# EasyEDA schematic SCH_esp32_custom.json
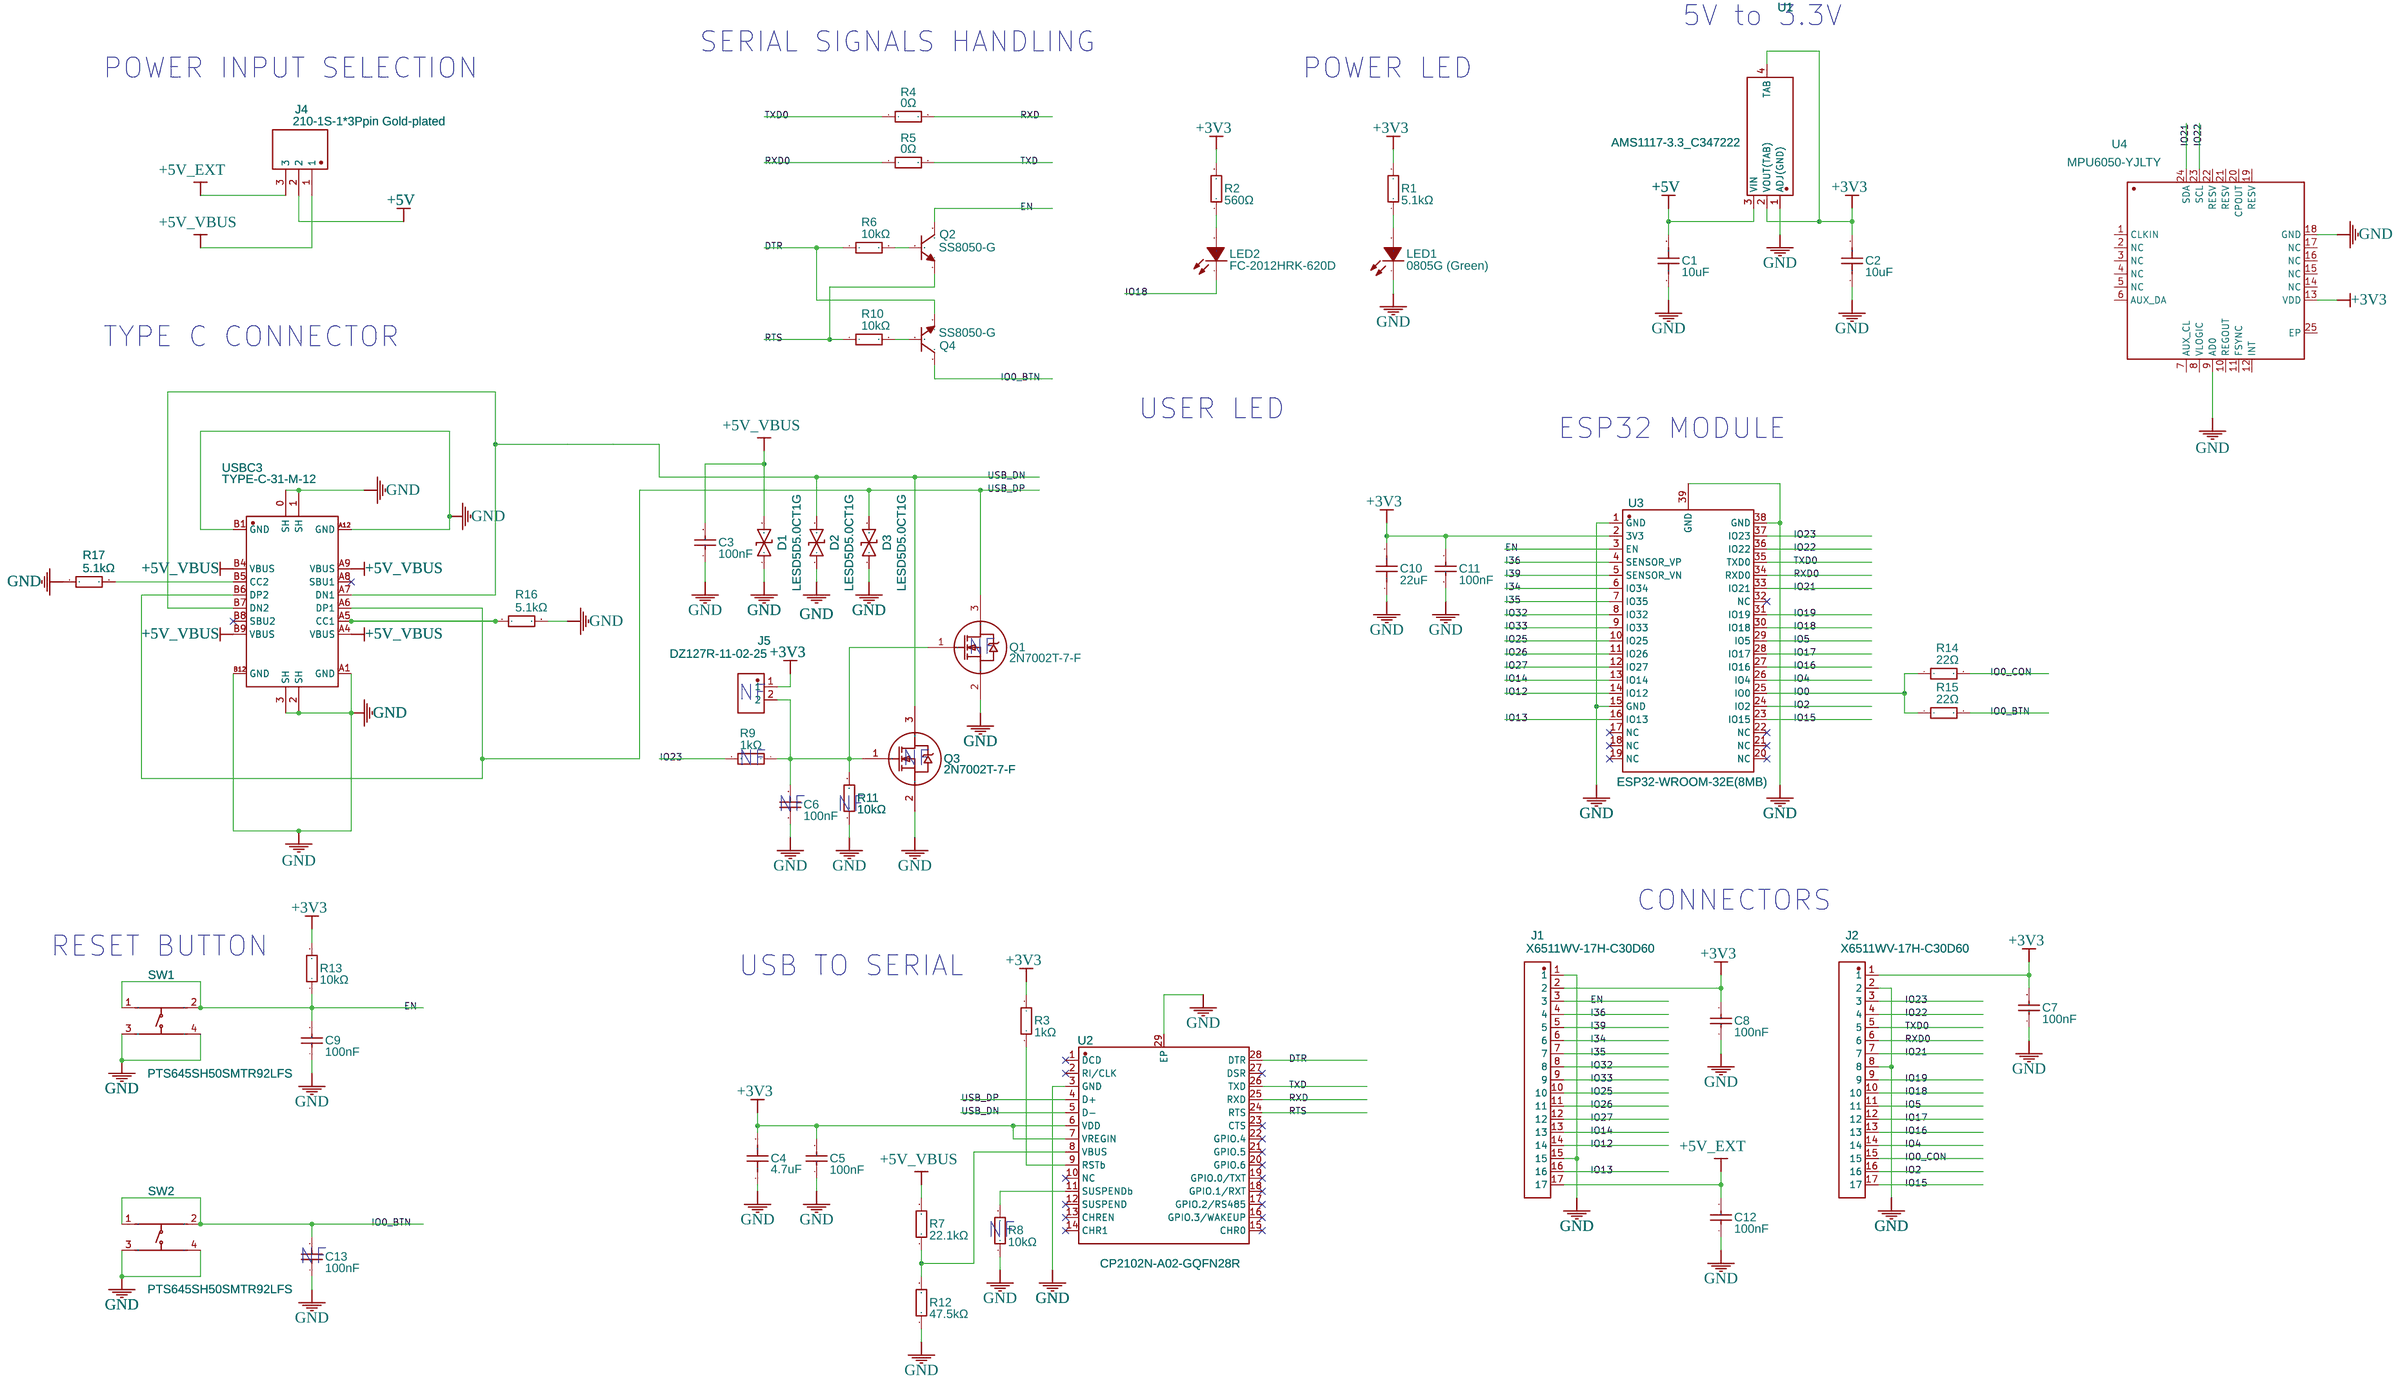
[diagram p0: schematic sheet]

## Parts
C1  10uF  [C0402]
C2  10uF  [C0402]
C3  100nF  [C0402_NEW]
C4  4.7uF  [C0402]
C5  100nF  [C0402_NEW]
C6  100nF  [C0402_NEW]
C7  100nF  [C0402_NEW]
C8  100nF  [C0402_NEW]
C9  100nF  [C0402_NEW]
C10  22uF  [C0805]
C11  100nF  [C0402_NEW]
C12  100nF  [C0402_NEW]
C13  100nF  [C0402_NEW]
D1  LESD5D5.0CT1G  [SOD-523_L1.2-W0.8-LS1.6-BI]
D2  LESD5D5.0CT1G  [SOD-523_L1.2-W0.8-LS1.6-BI]
D3  LESD5D5.0CT1G  [SOD-523_L1.2-W0.8-LS1.6-BI]
J1  X6511WV-17H-C30D60  [HDR-TH_17P-P2.54-V-M]
J2  X6511WV-17H-C30D60  [HDR-TH_17P-P2.54-V-M]
J4  210-1S-1*3Ppin Gold-plated  [HDR-TH_3P-P1.27-V-M-1]
J5  DZ127R-11-02-25  [HDR-TH_2P-P1.27-V-M]
LED1  0805G (Green)  [LED0805-RD_GREEN]
LED2  FC-2012HRK-620D  [LED0805-RD_RED]
Q1  2N7002T-7-F  [SOT-523-3_L1.6-W0.8-P1.00-LS1.6-BR]
Q2  SS8050-G  [SOT-23-3_L2.9-W1.6-P1.90-LS2.8-BR]
Q3  2N7002T-7-F  [SOT-523-3_L1.6-W0.8-P1.00-LS1.6-BR]
Q4  SS8050-G  [SOT-23-3_L2.9-W1.6-P1.90-LS2.8-BR]
R1  5.1kΩ  [R0402]
R2  560Ω  [R0402]
R3  1kΩ  [R0402]
R4  0Ω  [R0402]
R5  0Ω  [R0402]
R6  10kΩ  [R0402]
R7  22.1kΩ  [R0402]
R8  10kΩ  [R0402]
R9  1kΩ  [R0402]
R10  10kΩ  [R0402]
R11  10kΩ  [R0402]
R12  47.5kΩ  [R0402]
R13  10kΩ  [R0402]
R14  22Ω  [R0402]
R15  22Ω  [R0402]
R16  5.1kΩ  [R0603]
R17  5.1kΩ  [R0603]
SW1  PTS645SH50SMTR92LFS  [KEY-SMD_4P-L6.0-W6.0-P4.50-LS9.0]
SW2  PTS645SH50SMTR92LFS  [KEY-SMD_4P-L6.0-W6.0-P4.50-LS9.0]
U1  AMS1117-3.3_C347222  [SOT-223-4_L6.5-W3.5-P2.30-LS7.0-BR]
U2  CP2102N-A02-GQFN28R  [QFN-28_L5.0-W5.0-P0.50-TL-EP3.3]
U3  ESP32-WROOM-32E(8MB)  [WIFI-SMD_ESP32-WROOM-32E]
U4  MPU6050-YJLTY  [QFN-24_L4.0-W4.0-P0.50-BL-EP2.7]
USBC3  TYPE-C-31-M-12  [USB-C_SMD-TYPE-C-31-M-12]

## Library data of the parts
C1 C2 = CL05A106MP5NUNC_C315248: Supplier: LCSC; Supplier Part: C315248; Manufacturer: Samsung Electro-Mechanics; Manufacturer Part: CL05A106MP5NUNC; Contributor: LCSC; JLCPCB Part Class: Extended Part
C3 C5-C9 C11-C13 = CL05B104KO5NNNC: Supplier: LCSC; Manufacturer: SAMSUNG; Supplier Part: C1525; JLCPCB Part Class: Basic Part
C4 = CL05A475KP5NRNC: Supplier: LCSC; Supplier Part: C368809; Manufacturer: Samsung Electro-Mechanics; Contributor: LCSC; JLCPCB Part Class: Extended Part
C10 = CL21A226MAYNNNE: Supplier: LCSC; Supplier Part: C602037; Manufacturer: Samsung Electro-Mechanics; Contributor: LCSC; JLCPCB Part Class: Extended Part
D1-D3 = LESD5D5.0CT1G: Supplier: LCSC; Supplier Part: C383211; Manufacturer: Leshan Radio; Contributor: LCSC; JLCPCB Part Class: Extended Part
J1 J2 = X6511WV-17H-C30D60: Supplier: LCSC; Supplier Part: C725949; Manufacturer: XKB Connectivity; Contributor: LCSC; JLCPCB Part Class: Extended Part
J4 = 210-1S-1*3Ppin Gold-plated: Supplier: LCSC; Manufacturer: Ckmtw; Contributor: LCSC; Supplier Part: C124354; JLCPCB Part Class: Extended Part
J5 = DZ127R-11-02-25: Supplier: LCSC; Supplier Part: C2935942; Manufacturer: DEALON(德艺隆); Contributor: LCSC; JLCPCB Part Class: Extended Part
LED1 = 0805G (Green): Supplier: LCSC; Manufacturer: KENTO; Supplier Part: C2297; JLCPCB Part Class: Basic Part
LED2 = FC-2012HRK-620D: Supplier: LCSC; Manufacturer: NATIONSTAR; Supplier Part: C84256; JLCPCB Part Class: Basic Part
Q1 Q3 = 2N7002T-7-F: Supplier: LCSC; Manufacturer: DIODES; Contributor: LCSC; Supplier Part: C139445; JLCPCB Part Class: Extended Part
Q2 Q4 = SS8050-G: Supplier: LCSC; Manufacturer: CJ(江苏长电/长晶); Contributor: LCSC; Supplier Part: C164886; JLCPCB Part Class: Extended Part
R1 = 0402WGF5101TCE: Supplier: LCSC; Manufacturer: UniOhm; Supplier Part: C25905; Resistance (Ohms): 5.1K; JLCPCB Part Class: Basic Part
R2 = 0402WGF5600TCE: Supplier: LCSC; Manufacturer: UniOhm; Supplier Part: C25126; Resistance (Ohms): 560; JLCPCB Part Class: Extended Part
R3 R9 = 0402WGF1001TCE: Supplier: LCSC; Manufacturer: UniOhm; Supplier Part: C11702; Resistance (Ohms): 1K; JLCPCB Part Class: Basic Part
R4 R5 = 0402WGF0000TCE: Supplier: LCSC; Manufacturer: UniOhm; Supplier Part: C17168; Resistance (Ohms): 0; JLCPCB Part Class: Basic Part
R6 R8 R10 R11 R13 = 0402WGF1002TCE: Supplier: LCSC; Manufacturer: UniOhm; Supplier Part: C25744; Resistance (Ohms): 10K; JLCPCB Part Class: Basic Part
R7 = 0402WGF2212TCE: Supplier: LCSC; Manufacturer: UniOhm; Supplier Part: C43473; Resistance (Ohms): 22.1K; JLCPCB Part Class: Extended Part
R12 = 0402WGF4752TCE: Supplier: LCSC; Manufacturer: UniOhm; Supplier Part: C25896; Resistance (Ohms): 47.5K; JLCPCB Part Class: Extended Part
R14 R15 = 0402WGF220JTCE: Supplier: LCSC; Manufacturer: UniOhm; Supplier Part: C25092; Resistance (Ohms): 22; JLCPCB Part Class: Basic Part
R16 R17 = RC0603JR-075K1L: Supplier: LCSC; Manufacturer: YAGEO(国巨); Supplier Part: C14677; JLCPCB Part Class: Extended Part
SW1 SW2 = PTS645SH50SMTR92LFS: Supplier: LCSC; Supplier Part: C221869; Manufacturer: C&K; Contributor: LCSC; JLCPCB Part Class: Extended Part
U1 = AMS1117-3.3_C347222: Supplier: LCSC; Supplier Part: C347222; Manufacturer: Youtai Semiconductor Co., Ltd.; Manufacturer Part: AMS1117-3.3; Contributor: LCSC; JLCPCB Part Class: Extended Part
U2 = CP2102N-A02-GQFN28R: Supplier: LCSC; Supplier Part: C964632; Manufacturer: SILICON LABS(芯科); Contributor: LCSC; JLCPCB Part Class: Extended Part
U3 = ESP32-WROOM-32E(8MB): Supplier: LCSC; Supplier Part: C701342; Manufacturer: Espressif Systems; Contributor: LCSC; JLCPCB Part Class: Extended Part
U4 = MPU6050-YJLTY: Contributor: LCSC; Supplier: LCSC; Supplier Part: C2912107; Manufacturer: null; JLCPCB Part Class: Extended Part
USBC3 = TYPE-C-31-M-12: Contributor: LCSC; Supplier: LCSC; Supplier Part: C165948; Manufacturer: 韩国韩荣; JLCPCB Part Class: Extended Part

## Nets
+3V3: C2.2 C4.2 C5.2 C7.2 C8.2 C10.2 C11.2 J1.2 J2.1 J5.1 R1.2 R2.2 R3.2 R13.2 U1.2(VOUT(TAB)) U1.4(TAB) U2.6(VDD) U2.7(VREGIN) U3.2(3V3) U4.13(VDD)
+5V: C1.2 J4.2 U1.3(VIN)
+5V_EXT: C12.2 J1.17 J4.3
+5V_VBUS: C3.2 D1.2 J4.1 R7.2 USBC3.A4(VBUS) USBC3.A9(VBUS) USBC3.B4(VBUS) USBC3.B9(VBUS)
GND: C1.1 C2.1 C3.1 C4.1 C5.1 C6.1 C7.1 C8.1 C9.1 C10.1 C11.1 C12.1 C13.1 D1.1 D2.1 D3.1 J1.1 J1.15 J2.2 J2.8 LED1.1(K) Q1.2(S) Q3.2(S) R8.1 R11.1 R12.1 R16.2 R17.1 SW1.3 SW1.4 SW2.3 SW2.4 U1.1(ADJ(GND)) U2.3(GND) U2.29(EP) U3.1(GND) U3.15(GND) U3.38(GND) U3.39(GND) U4.9(AD0) U4.18(GND) USBC3.0(SH) USBC3.1(SH) USBC3.2(SH) USBC3.3(SH) USBC3.A1(GND) USBC3.A12(GND) USBC3.B1(GND) USBC3.B12(GND)
DTR: Q4.2(E) R6.1 U2.28(DTR)
EN: C9.2 J1.3 Q2.3(C) R13.1 SW1.1 SW1.2 U3.3(EN)
I34: J1.6 U3.6(IO34)
I35: J1.7 U3.7(IO35)
I36: J1.4 U3.4(SENSOR_VP)
I39: J1.5 U3.5(SENSOR_VN)
IO0: R14.1 R15.1 U3.25(IO0)
IO0_BTN: C13.2 Q4.3(C) R15.2 SW2.1 SW2.2
IO0_CON: J2.15 R14.2
IO2: J2.16 U3.24(IO2)
IO4: J2.14 U3.26(IO4)
IO5: J2.11 U3.29(IO5)
IO12: J1.14 U3.14(IO12)
IO13: J1.16 U3.16(IO13)
IO14: J1.13 U3.13(IO14)
IO15: J2.17 U3.23(IO15)
IO16: J2.13 U3.27(IO16)
IO17: J2.12 U3.28(IO17)
IO18: J2.10 LED2.1(-) U3.30(IO18)
IO19: J2.9 U3.31(IO19)
IO21: J2.7 U3.33(IO21) U4.24(SDA)
IO22: J2.4 U3.36(IO22) U4.23(SCL)
IO23: J2.3 R9.2 U3.37(IO23)
IO25: J1.10 U3.10(IO25)
IO26: J1.11 U3.11(IO26)
IO27: J1.12 U3.12(IO27)
IO32: J1.8 U3.8(IO32)
IO33: J1.9 U3.9(IO33)
RTS: Q2.2(E) R10.1 U2.24(RTS)
RXD: R4.2 U2.25(RXD)
RXD0: J2.6 R5.1 U3.34(RXD0)
TXD: R5.2 U2.26(TXD)
TXD0: J2.5 R4.1 U3.35(TXD0)
USB_DN: D2.2 Q3.3(D) U2.5(D-) USBC3.A7(DN1) USBC3.B7(DN2)
USB_DP: D3.2 Q1.3(D) U2.4(D+) USBC3.A6(DP1) USBC3.B6(DP2)
Net-(C6-2): C6.2 J5.2 Q1.1(G) Q3.1(G) R9.1 R11.2
Net-(LED1-2): LED1.2(A) R1.1
Net-(LED2-2): LED2.2(+) R2.1
Net-(Q2-1): Q2.1(B) R6.2
Net-(Q4-1): Q4.1(B) R10.2
Net-(R3-1): R3.1 U2.9(RSTb)
Net-(R7-1): R7.1 R12.2 U2.8(VBUS)
Net-(R8-2): R8.2 U2.11(SUSPENDb)
Net-(R16-1): R16.1 USBC3.A5(CC1)
Net-(R17-2): R17.2 USBC3.B5(CC2)

Not connected (* = marked no-connect by the designer): U2 1(DCD)* 2(RI/CLK)* 10(NC)* 12(SUSPEND)* 13(CHREN)* 14(CHR1)* 15(CHR0)* 16(GPIO.3/WAKEUP)* 17(GPIO.2/RS485)* 18(GPIO.1/RXT)* 19(GPIO.0/TXT)* 20(GPIO.6)* 21(GPIO.5)* 22(GPIO.4)* 23(CTS)* 27(DSR)*; U3 17(NC)* 18(NC)* 19(NC)* 20(NC)* 21(NC)* 22(NC)* 32(NC)*; U4 1(CLKIN) 2(NC) 3(NC) 4(NC) 5(NC) 6(AUX_DA) 7(AUX_CL) 8(VLOGIC) 10(REGOUT) 11(FSYNC) 12(INT) 14(NC) 15(NC) 16(NC) 17(NC) 19(RESV) 20(CPOUT) 21(RESV) 22(RESV) 25(EP); USBC3 A8(SBU1)* B8(SBU2)*

## Notes on the sheet
- 5V to 3.3V
- SERIAL SIGNALS HANDLING
- POWER INPUT SELECTION
- POWER LED
- TYPE C CONNECTOR
- USER LED
- ESP32 MODULE
- NF
- NF
- NF
- NF
- NF
- NF
- CONNECTORS
- RESET BUTTON
- USB TO SERIAL
- NF
- NF
